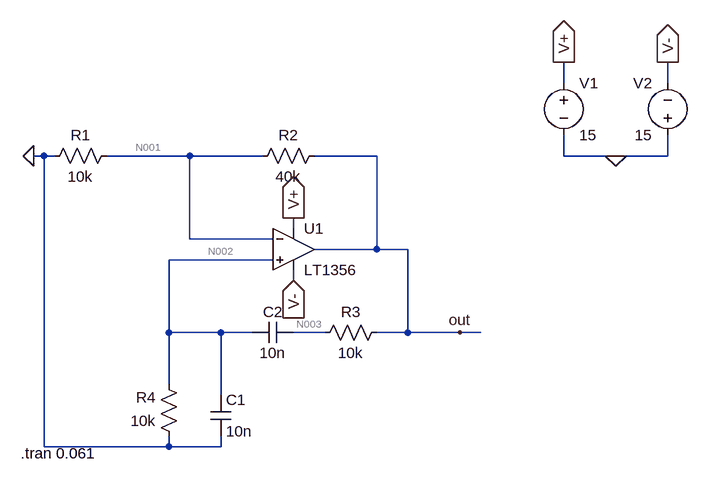
[diagram p0: schematic Wein Bridge.asc]
Wein Bridge.asc, the LTspice schematic file:
Version 4
SHEET 1 888 680
WIRE 656 -112 656 -144
WIRE 816 -112 816 -144
WIRE -144 0 -160 0
WIRE -128 0 -144 0
WIRE 80 0 -48 0
WIRE 192 0 80 0
WIRE 368 0 272 0
WIRE 656 0 656 -32
WIRE 736 0 656 0
WIRE 816 0 816 -32
WIRE 816 0 736 0
WIRE 240 112 240 96
WIRE 80 128 80 0
WIRE 208 128 80 128
WIRE 368 144 368 0
WIRE 368 144 272 144
WIRE 416 144 368 144
WIRE 208 160 48 160
WIRE 240 192 240 176
WIRE 48 272 48 160
WIRE 128 272 48 272
WIRE 176 272 128 272
WIRE 288 272 240 272
WIRE 416 272 416 144
WIRE 416 272 368 272
WIRE 496 272 416 272
WIRE 528 272 496 272
WIRE 48 352 48 272
WIRE 128 368 128 272
WIRE -144 448 -144 0
WIRE 48 448 48 432
WIRE 48 448 -144 448
WIRE 128 448 128 432
WIRE 128 448 48 448
FLAG -160 0 0
FLAG 656 -144 V+
IOPIN 656 -144 Out
FLAG 816 -144 V-
IOPIN 816 -144 Out
FLAG 240 96 V+
IOPIN 240 96 Out
FLAG 240 192 V-
IOPIN 240 192 In
FLAG 736 0 0
FLAG 496 272 out
SYMBOL OpAmps\\LT1356 240 80 R0
SYMATTR InstName U1
SYMBOL res -32 -16 R90
WINDOW 0 0 56 VBottom 2
WINDOW 3 32 56 VTop 2
SYMATTR InstName R1
SYMATTR Value 10k
SYMBOL res 288 -16 R90
WINDOW 0 0 56 VBottom 2
WINDOW 3 32 56 VTop 2
SYMATTR InstName R2
SYMATTR Value 40k
SYMBOL res 384 256 R90
WINDOW 0 0 56 VBottom 2
WINDOW 3 32 56 VTop 2
SYMATTR InstName R3
SYMATTR Value 10k
SYMBOL res 64 448 R180
WINDOW 0 36 76 Left 2
WINDOW 3 36 40 Left 2
SYMATTR InstName R4
SYMATTR Value 10k
SYMBOL cap 112 368 R0
SYMATTR InstName C1
SYMATTR Value 10n
SYMBOL cap 240 256 R90
WINDOW 0 0 32 VBottom 2
WINDOW 3 32 32 VTop 2
SYMATTR InstName C2
SYMATTR Value 10n
SYMBOL voltage 656 -128 R0
WINDOW 123 0 0 Left 0
WINDOW 39 0 0 Left 0
SYMATTR InstName V1
SYMATTR Value 15
SYMBOL voltage 816 -16 R180
WINDOW 0 24 96 Left 2
WINDOW 3 24 16 Left 2
WINDOW 123 0 0 Left 0
WINDOW 39 0 0 Left 0
SYMATTR InstName V2
SYMATTR Value 15
TEXT -180 458 Left 2 !.tran 0.061

The netlist it stands for:
* Wein Bridge.asc
XU1 N002 N001 V+ V- out LT1356  ; pins In+ In- V+ V- OUT
R1 N001 0 10k
R2 out N001 40k
R3 out N003 10k
R4 0 N002 10k
C1 N002 0 10n
C2 N003 N002 10n
V1 V+ 0 15
V2 0 V- 15
.tran 0.061
.backanno
.end

* Results of the author's LTspice run, read from the files saved beside the schematic
* Operating Point, zero values left out:
*   V(n001) = -805.9 µV
*   V(n002) = -805.9 µV
*   V(v+) = 15 V
*   V(out) = -805.8 µV
*   V(v-) = -15 V
*   V(n003) = -805.8 µV
*   I(R4) = 80.59 nA
*   I(R2) = 2.241 pA
*   I(R1) = -80.59 nA
*   I(V2) = -994.3 µA
*   I(V1) = -994.2 µA
*   Ix(u1:1) = 80.59 nA
*   Ix(u1:2) = 80.59 nA
*   Ix(u1:3) = 994.2 µA
*   Ix(u1:4) = -994.3 µA
*   Ix(u1:5) = -2.239 pA
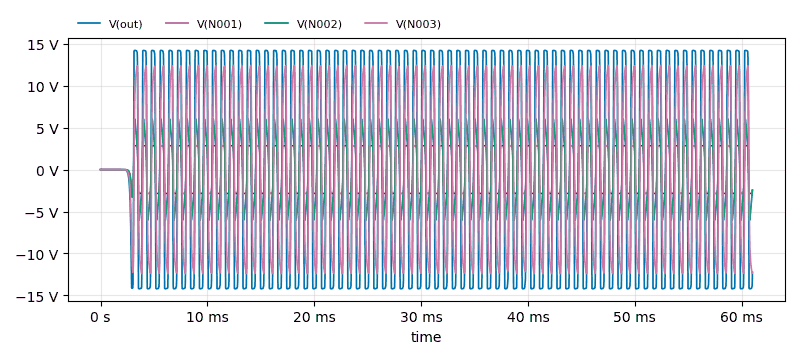
[diagram p1: Transient Analysis of Wein Bridge.asc, plotted from the saved traces]
* Transient Analysis, 1 run:
*   V(out): min -14.22 V, max 14.22 V, average -56.3 mV, rms 12.88 V, last -12.28 V
*   V(N001): min -2.846 V, max 2.845 V, average -11.91 mV, rms 2.577 V, last -2.458 V
*   V(N002): min -6.06 V, max 6.057 V, average -13.22 mV, rms 4.144 V, last -2.457 V
*   V(N003): min -12.41 V, max 12.41 V, average -39.92 mV, rms 9.768 V, last -12.21 V